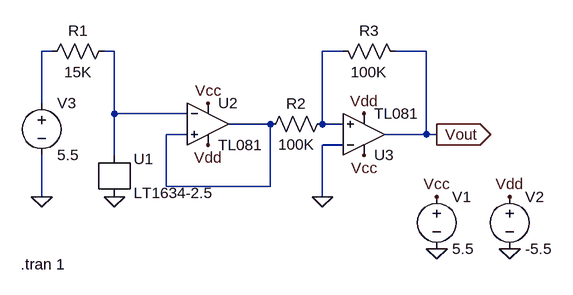
[diagram p0: schematic SpaendingsRef_komparator.asc]
SpaendingsRef_komparator.asc, the LTspice schematic file:
Version 4
SHEET 1 880 680
WIRE -128 -432 -144 -432
WIRE -32 -432 -48 -432
WIRE 320 -432 288 -432
WIRE 448 -432 400 -432
WIRE -144 -352 -144 -432
WIRE -32 -336 -32 -432
WIRE 80 -336 -32 -336
WIRE 208 -320 144 -320
WIRE 288 -320 288 -432
WIRE 320 -320 288 -320
WIRE 80 -304 48 -304
WIRE 448 -304 448 -432
WIRE 448 -304 384 -304
WIRE 464 -304 448 -304
WIRE 320 -288 288 -288
WIRE -32 -272 -32 -336
WIRE 48 -224 48 -304
WIRE 208 -224 208 -320
WIRE 208 -224 48 -224
WIRE -144 -208 -144 -272
WIRE 288 -208 288 -288
FLAG -32 -208 0
FLAG 288 -208 0
FLAG 464 -304 Vout
IOPIN 464 -304 Out
FLAG 464 -128 0
FLAG 576 -128 0
FLAG 464 -208 Vcc
FLAG 112 -352 Vcc
FLAG 352 -272 Vcc
FLAG 112 -288 Vdd
FLAG 352 -336 Vdd
FLAG 576 -208 Vdd
FLAG -144 -208 0
SYMBOL References\\LT1634-2.5 -32 -240 R0
SYMATTR InstName U1
SYMBOL res -144 -416 R270
WINDOW 0 32 56 VTop 2
WINDOW 3 0 56 VBottom 2
SYMATTR InstName R1
SYMATTR Value 15K
SYMBOL voltage -144 -368 R0
WINDOW 123 0 0 Left 2
WINDOW 39 0 0 Left 2
SYMATTR InstName V3
SYMATTR Value 5.5
SYMBOL Opamps\\TL081 112 -384 R0
SYMATTR InstName U2
SYMBOL Opamps\\TL081 352 -240 M180
SYMATTR InstName U3
SYMBOL res 304 -336 R90
WINDOW 0 0 56 VBottom 2
WINDOW 3 32 56 VTop 2
SYMATTR InstName R2
SYMATTR Value 100K
SYMBOL res 416 -416 M270
WINDOW 0 32 56 VTop 2
WINDOW 3 0 56 VBottom 2
SYMATTR InstName R3
SYMATTR Value 100K
SYMBOL voltage 464 -224 R0
SYMATTR InstName V1
SYMATTR Value 5.5
SYMBOL voltage 576 -224 R0
SYMATTR InstName V2
SYMATTR Value -5.5
TEXT -176 -104 Left 2 !.tran 1

The netlist it stands for:
* SpaendingsRef_komparator.asc
XU1 N002 0 LT1634-2.5
R1 N001 N002 15K
V3 N001 0 5.5
XU2 N004 N002 Vcc Vdd N004 TL081  ; pins In+ In- V+ V- OUT
XU3 N003 0 Vcc Vdd Vout TL081  ; pins In+ In- V+ V- OUT
R2 N003 N004 100K
R3 Vout N003 100K
V1 Vcc 0 5.5
V2 Vdd 0 -5.5
.tran 1
.backanno
.end